# Altium project NASA.PrjPcb
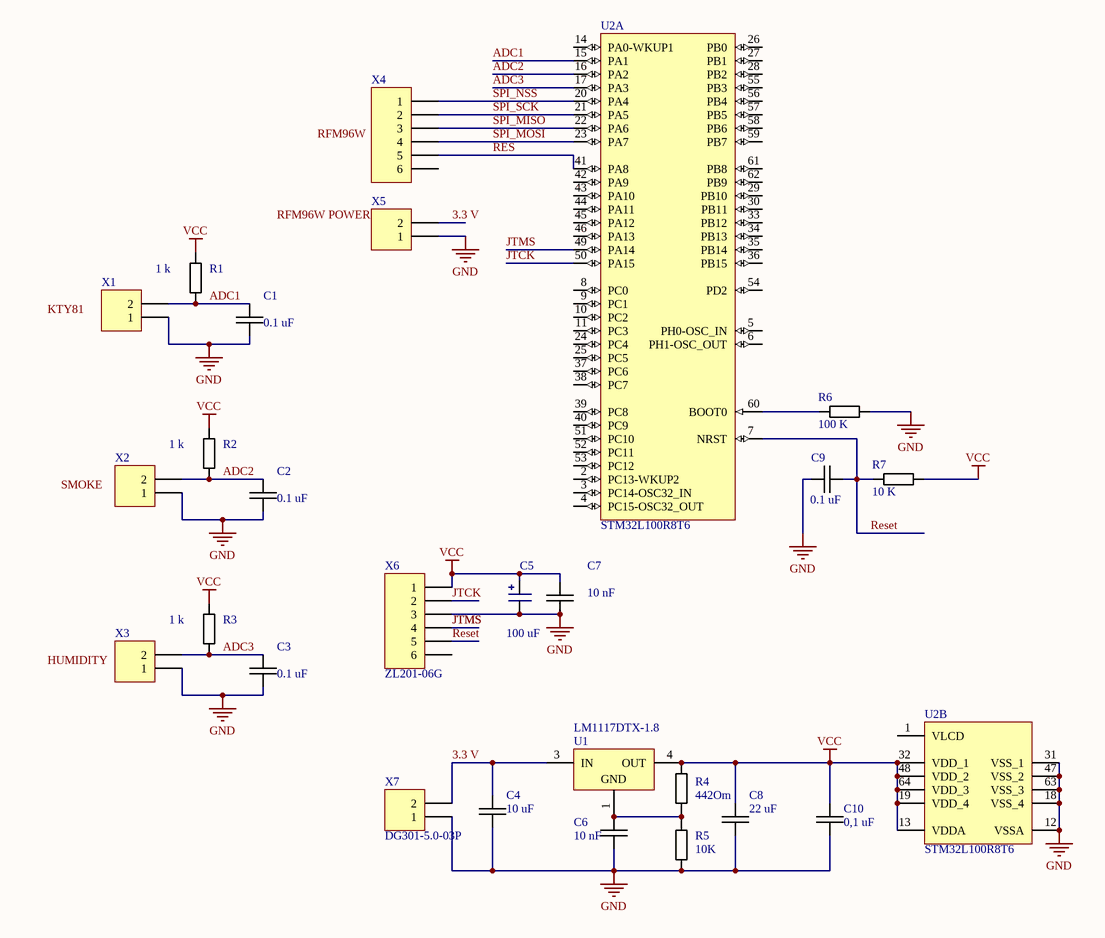
[diagram p0: NASA.SchDoc]
1 sheet, 26 parts. Net scope: global (net labels, ports and power ports of the same name join across sheets).
Board file: NASA.PcbDoc

## Sheet NASA.SchDoc
size A3

### Parts
C1  0.1 uF  [CAPACITOR 0805]
C2  0.1 uF  [CAPACITOR 0805]
C3  0.1 uF  [CAPACITOR 0805]
C4  10 uF  [CAPACITOR 0805]
C5  100 uF  [D4.15]
C6  10 nF  [CAPACITOR 0805]
C7  10 nF  [CAPACITOR 0805]
C8  22 uF  [CAPACITOR 0805]
C9  0.1 uF  [CAPACITOR 0805]
C10  0,1 uF  [CAPACITOR 0805]
R1  1 k  [Resistor 0805]
R2  1 k  [Resistor 0805]
R3  1 k  [Resistor 0805]
R4  442Om  [Resistor 0805]
R5  10K  [Resistor 0805]
R6  100 K  [Resistor 0805]
R7  10 K  [Resistor 0805]
U1  LM1117DTX-1.8  [MF03A_N]
U2  STM32L100R8T6  [STM-LQFP64_N]  (parts A,B of 2)
X1  (no value)  [DG301-5.0-02P]
X2  (no value)  [DG301-5.0-02P]
X3  (no value)  [DG301-5.0-02P]
X4  (no value)  [PLS-6-3D]
X5  (no value)  [DG301-5.0-02P]
X6  ZL201-06G  [PLS-6-3D]
X7  DG301-5.0-03P  [DG301-5.0-02P]

### Nets
GND: C1.2 C2.2 C3.2 C4.1 C5.2 C6.1 C7.1 C8.1 C9.1 C10.2 R5.1 R6.2 U2.12(VSSA) U2.18(VSS_4) U2.31(VSS_1) U2.47(VSS_2) U2.63(VSS_3) X1.1 X2.1 X3.1 X5.1 X6.3 X7.1
VCC: C5.1 C7.2 C8.2 C10.1 R1.1 R2.1 R3.1 R4.2 R7.2 U1.4(OUT) U2.13(VDDA) U2.19(VDD_4) U2.32(VDD_1) U2.48(VDD_2) U2.64(VDD_3) X6.1
3.3 V: C4.2 U1.3(IN) X5.2 X7.2
ADC1: C1.1 R1.2 U2.15(PA1) X1.2
ADC2: C2.1 R2.2 U2.16(PA2) X2.2
ADC3: C3.1 R3.2 U2.17(PA3) X3.2
JTCK: U2.50(PA15) X6.2
JTMS: U2.49(PA14) X6.4
RES: U2.41(PA8) X4.5
Reset: C9.2 R7.1 U2.7(NRST) X6.5
SPI_MISO: U2.22(PA6) X4.3
SPI_MOSI: U2.23(PA7) X4.4
SPI_NSS: U2.20(PA4) X4.1
SPI_SCK: U2.21(PA5) X4.2
NetC6_2: C6.2 R4.1 R5.2 U1.1(GND)
NetR6_1: R6.1 U2.60(BOOT0)

Not connected (* = marked no-connect by the designer): U2 1(VLCD) 2(PC13-WKUP2) 3(PC14-OSC32_IN) 4(PC15-OSC32_OUT) 5(PH0-OSC_IN) 6(PH1-OSC_OUT) 8(PC0) 9(PC1) 10(PC2) 11(PC3) 14(PA0-WKUP1) 24(PC4) 25(PC5) 26(PB0) 27(PB1) 28(PB2) 29(PB10) 30(PB11) 33(PB12) 34(PB13) 35(PB14) 36(PB15) 37(PC6) 38(PC7) 39(PC8) 40(PC9) 42(PA9) 43(PA10) 44(PA11) 45(PA12) 46(PA13) 51(PC10) 52(PC11) 53(PC12) 54(PD2) 55(PB3) 56(PB4) 57(PB5) 58(PB6) 59(PB7) 61(PB8) 62(PB9); X4 6; X6 6

### Notes on the sheet
- Labels drawn without touching a wire or pin: HUMIDITY, KTY81, RFM96W, RFM96W POWER, SMOKE

### Library data of the parts
C1-C4 C6-C10 = Capasitor: Value: *
C5 = C_E: Cap: 100uF; Volts: 16V
R1-R7 = Resistor: Value: *
U1 = LM1117DTX-1.8: 800mA Low-Dropout Linear Regulator, 3-pin TO-252; pin to pad: 4>2; Manufacturer: National Semiconductor; PackageTopMarking: NSUZXYTT*LM1117*DT-1.8; PowerWise: N; CompType: LDO IC; High-Reliability: Y; DatasheetVersion: Apr-2006; PackageVersion: revD, Feb-2009; PackageReference: TD03B; PackageDescription: TO252, Molded, Jedec, 6.8 x 6.10 x 2.30mm Body, 3 Lead, 2.28mm Pitch, Surface Mount; PartNumber: LM1117DTX-1.8; RoHS: N; PinCount: 3; Code_JEDEC: TO-252-AA; ComponentLink1Description: Manufacturer URL; ComponentLink1URL: http://www.national.com/; ComponentLink2Description: LM1117 Datasheet; ComponentLink2URL: http://www.national.com/ds/LM/LM1117.pdf; ComponentLink3Description: LM1117 Web Page; ComponentLink3URL: http://www.national.com/pf/LM/LM1117.html; ComponentLink4Description: TD03B Package Page; ComponentLink4URL: http://www.national.com/packaging/folders/td03b.html
U2 = STM32L100R8T6: ARM Cortex-M3 32-bit MCU, 64 KB Flash, 8 KB Internal RAM, 51 I/Os, 64-pin LQFP, -40 to 85 degC, Tray; Manufacturer: STMicroelectronics; D/A Converter: 2x12-bit (2 Channel); Data E2PROM nom (B): 2048; Display controller: LCD 4x32/8x28; FLASH Size (Prog) (kB): 64; I/Os (High Current): 51; Internal RAM Size (kB): 8; Operating Frequency(F) (Processor speed) (MHz): 32; Supply Voltage(Vcc) min (V): 1.8; DatasheetVersion: Rev. 1; PackageVersion: Rev. 4, 06/2013; PackageReference: LQFP64; PackageDescription: 64-Pin Low Profile Quad Flat Package, 10 x 10 mm Body, 0.5 mm Pitch; Core: ARM Cortex-M3; Packing: Tray; Mounting Technology: Surface Mount; PartNumber: STM32L100R8T6; ComponentLink1Description: Manufacturer URL; ComponentLink1URL: http://www.st.com/web/en/home.html; ComponentLink2Description: Datasheet; ComponentLink2URL: http://www.st.com/st-web-ui/static/active/en/resource/technical/document/datasheet/DM00078075.pdf; ComponentLink3Description: Package Specification; ComponentLink3URL: http://www.st.com/st-web-ui/static/active/en/resource/technical/document/datasheet/DM00037051.pdf
X1-X3 X5 X7 = DG301-5.0-02P-12-00A
X4 X6 = PLS-6: Header, 6-Pin; LatestRevisionDate: 17-Jul-2002; LatestRevisionNote: Re-released for DXP Platform.; Publisher: Altium Limited